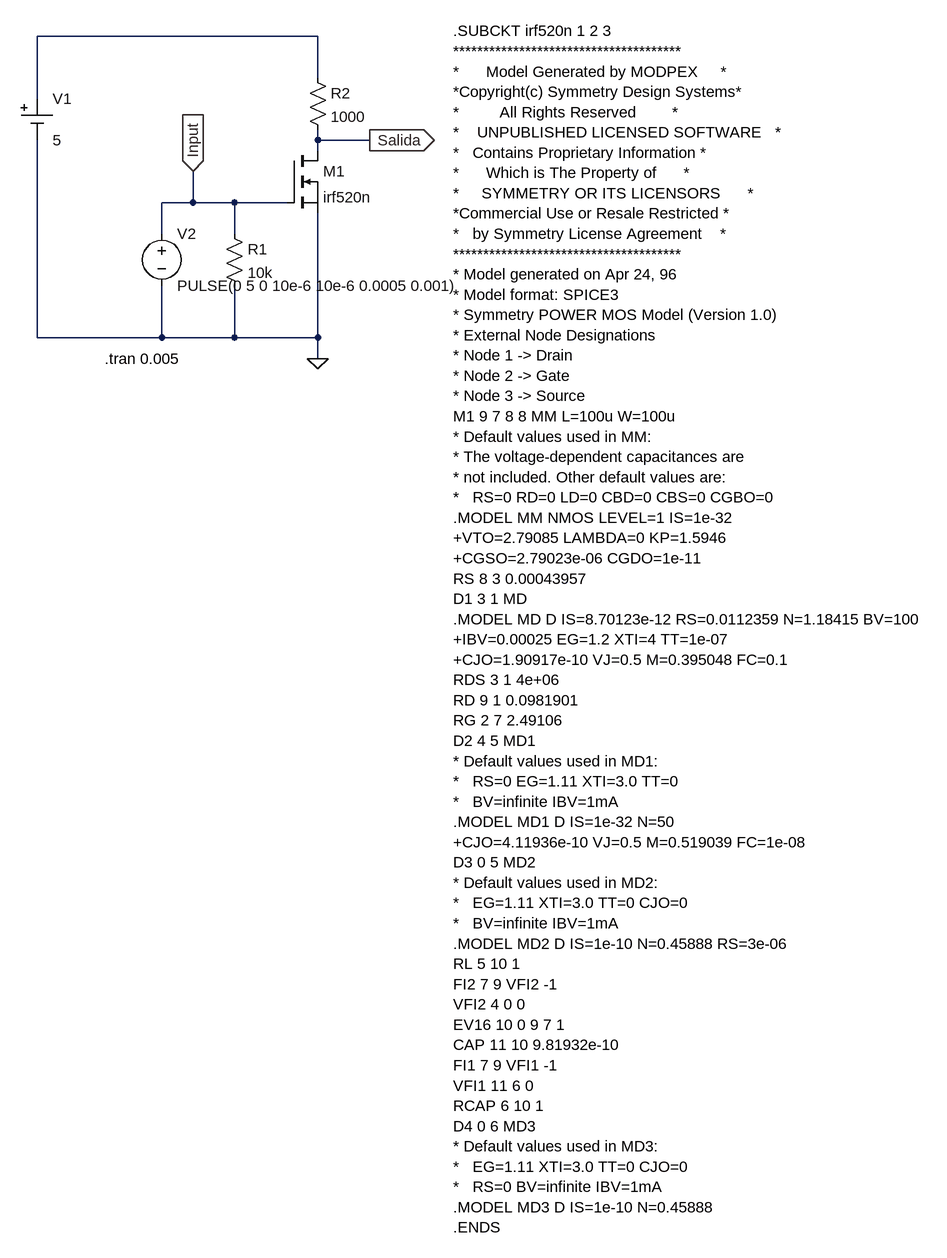
[diagram p0: schematic Practica 5-1.asc]
Practica 5-1.asc, the LTspice schematic file:
Version 4
SHEET 1 1468 1832
WIRE 480 48 48 48
WIRE 480 112 480 48
WIRE 48 144 48 48
WIRE 480 208 480 192
WIRE 560 208 480 208
WIRE 480 224 480 208
WIRE 288 304 288 256
WIRE 288 304 240 304
WIRE 352 304 288 304
WIRE 432 304 352 304
WIRE 240 352 240 304
WIRE 352 352 352 304
WIRE 48 512 48 208
WIRE 240 512 240 432
WIRE 240 512 48 512
WIRE 352 512 352 432
WIRE 352 512 240 512
WIRE 480 512 480 320
WIRE 480 512 352 512
WIRE 480 544 480 512
FLAG 480 544 0
FLAG 288 256 Input
IOPIN 288 256 In
FLAG 560 208 Salida
IOPIN 560 208 Out
SYMBOL Misc\\cell 48 144 R0
SYMATTR InstName V1
SYMATTR Value 5
SYMBOL voltage 240 336 R0
SYMATTR InstName V2
SYMATTR Value PULSE(0 5 0 10e-6 10e-6 0.0005 0.001)
SYMBOL res 336 336 R0
SYMATTR InstName R1
SYMATTR Value 10k
SYMBOL res 464 96 R0
SYMATTR InstName R2
SYMATTR Value 1000
SYMBOL nmos 432 224 R0
SYMATTR InstName M1
SYMATTR Value irf520n
SYMATTR Prefix X
TEXT 688 40 Left 2 !.SUBCKT irf520n 1 2 3\n**************************************\n*      Model Generated by MODPEX     *\n*Copyright(c) Symmetry Design Systems*\n*         All Rights Reserved        *\n*    UNPUBLISHED LICENSED SOFTWARE   *\n*   Contains Proprietary Information *\n*      Which is The Property of      *\n*     SYMMETRY OR ITS LICENSORS      *\n*Commercial Use or Resale Restricted *\n*   by Symmetry License Agreement    *\n**************************************\n* Model generated on Apr 24, 96\n* Model format: SPICE3\n* Symmetry POWER MOS Model (Version 1.0)\n* External Node Designations\n* Node 1 -> Drain\n* Node 2 -> Gate\n* Node 3 -> Source\nM1 9 7 8 8 MM L=100u W=100u\n* Default values used in MM:\n* The voltage-dependent capacitances are\n* not included. Other default values are:\n*   RS=0 RD=0 LD=0 CBD=0 CBS=0 CGBO=0\n.MODEL MM NMOS LEVEL=1 IS=1e-32\n+VTO=2.79085 LAMBDA=0 KP=1.5946\n+CGSO=2.79023e-06 CGDO=1e-11\nRS 8 3 0.00043957\nD1 3 1 MD\n.MODEL MD D IS=8.70123e-12 RS=0.0112359 N=1.18415 BV=100\n+IBV=0.00025 EG=1.2 XTI=4 TT=1e-07\n+CJO=1.90917e-10 VJ=0.5 M=0.395048 FC=0.1\nRDS 3 1 4e+06\nRD 9 1 0.0981901\nRG 2 7 2.49106\nD2 4 5 MD1\n* Default values used in MD1:\n*   RS=0 EG=1.11 XTI=3.0 TT=0\n*   BV=infinite IBV=1mA\n.MODEL MD1 D IS=1e-32 N=50\n+CJO=4.11936e-10 VJ=0.5 M=0.519039 FC=1e-08\nD3 0 5 MD2\n* Default values used in MD2:\n*   EG=1.11 XTI=3.0 TT=0 CJO=0\n*   BV=infinite IBV=1mA\n.MODEL MD2 D IS=1e-10 N=0.45888 RS=3e-06\nRL 5 10 1\nFI2 7 9 VFI2 -1\nVFI2 4 0 0\nEV16 10 0 9 7 1\nCAP 11 10 9.81932e-10\nFI1 7 9 VFI1 -1\nVFI1 11 6 0\nRCAP 6 10 1\nD4 0 6 MD3\n* Default values used in MD3:\n*   EG=1.11 XTI=3.0 TT=0 CJO=0\n*   RS=0 BV=infinite IBV=1mA\n.MODEL MD3 D IS=1e-10 N=0.45888\n.ENDS
TEXT 152 544 Left 2 !.tran 0.005

The netlist it stands for:
* Practica 5-1.asc
V1 N001 0 5
V2 Input 0 PULSE(0 5 0 10e-6 10e-6 0.0005 0.001)
R1 Input 0 10k
R2 N001 Salida 1000
XM1 Salida Input 0 irf520n  ; pins D G S
.SUBCKT irf520n 1 2 3
**************************************
*      Model Generated by MODPEX     *
*Copyright(c) Symmetry Design Systems*
*         All Rights Reserved        *
*    UNPUBLISHED LICENSED SOFTWARE   *
*   Contains Proprietary Information *
*      Which is The Property of      *
*     SYMMETRY OR ITS LICENSORS      *
*Commercial Use or Resale Restricted *
*   by Symmetry License Agreement    *
**************************************
* Model generated on Apr 24, 96
* Model format: SPICE3
* Symmetry POWER MOS Model (Version 1.0)
* External Node Designations
* Node 1 -> Drain
* Node 2 -> Gate
* Node 3 -> Source
M1 9 7 8 8 MM L=100u W=100u
* Default values used in MM:
* The voltage-dependent capacitances are
* not included. Other default values are:
*   RS=0 RD=0 LD=0 CBD=0 CBS=0 CGBO=0
.MODEL MM NMOS LEVEL=1 IS=1e-32
+VTO=2.79085 LAMBDA=0 KP=1.5946
+CGSO=2.79023e-06 CGDO=1e-11
RS 8 3 0.00043957
D1 3 1 MD
.MODEL MD D IS=8.70123e-12 RS=0.0112359 N=1.18415 BV=100
+IBV=0.00025 EG=1.2 XTI=4 TT=1e-07
+CJO=1.90917e-10 VJ=0.5 M=0.395048 FC=0.1
RDS 3 1 4e+06
RD 9 1 0.0981901
RG 2 7 2.49106
D2 4 5 MD1
* Default values used in MD1:
*   RS=0 EG=1.11 XTI=3.0 TT=0
*   BV=infinite IBV=1mA
.MODEL MD1 D IS=1e-32 N=50
+CJO=4.11936e-10 VJ=0.5 M=0.519039 FC=1e-08
D3 0 5 MD2
* Default values used in MD2:
*   EG=1.11 XTI=3.0 TT=0 CJO=0
*   BV=infinite IBV=1mA
.MODEL MD2 D IS=1e-10 N=0.45888 RS=3e-06
RL 5 10 1
FI2 7 9 VFI2 -1
VFI2 4 0 0
EV16 10 0 9 7 1
CAP 11 10 9.81932e-10
FI1 7 9 VFI1 -1
VFI1 11 6 0
RCAP 6 10 1
D4 0 6 MD3
* Default values used in MD3:
*   EG=1.11 XTI=3.0 TT=0 CJO=0
*   RS=0 BV=infinite IBV=1mA
.MODEL MD3 D IS=1e-10 N=0.45888
.ENDS
.tran 0.005
.backanno
.end